# Altium schematic sheet EEG_TI.SchDoc
size A4
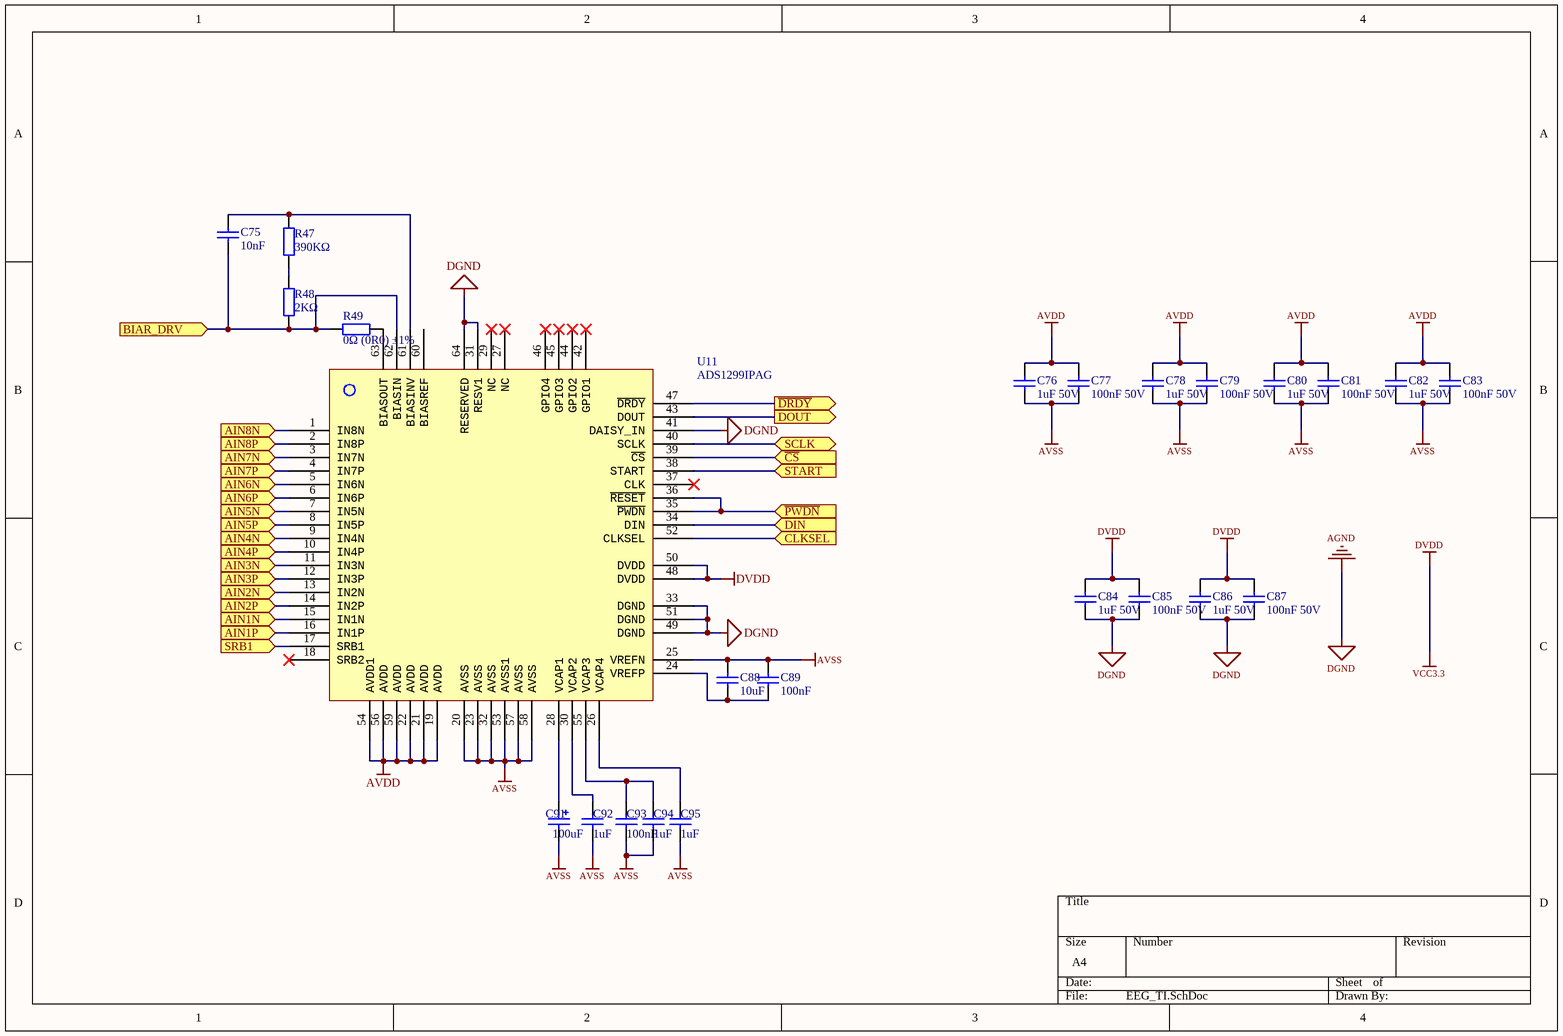
[diagram p0: EEG_TI.SchDoc]

## Parts
C75  10nF  [0402_C]
C76  1uF 50V  [0402_C]
C77  100nF 50V  [0402_C]
C78  1uF 50V  [0402_C]
C79  100nF 50V  [0402_C]
C80  1uF 50V  [0402_C]
C81  100nF 50V  [0402_C]
C82  1uF 50V  [0402_C]
C83  100nF 50V  [0402_C]
C84  1uF 50V  [0402_C]
C85  100nF 50V  [0402_C]
C86  1uF 50V  [0402_C]
C87  100nF 50V  [0402_C]
C88  10uF  [0402_C]
C89  100nF  [0402_C]
C91  100uF  [CASE-B_3528]
C92  1uF  [0603_C]
C93  100nF  [0402_C]
C94  1uF  [0603_C]
C95  1uF  [0603_C]
R47  390KΩ  [0603_R]
R48  2KΩ  [0402_R]
R49  0Ω (0R0) ±1%  [0402_R]
U11  ADS1299IPAG  [ADS1299]

## Ports
AIN1N (in), AIN1P (in), AIN2N (in), AIN2P (in), AIN3N (in), AIN3P (in), AIN4N (in), AIN4P (in), AIN5N (in), AIN5P (in), AIN6N (in), AIN6P (in), AIN7N (in), AIN7P (in), AIN8N (in), AIN8P (in), BIAR_DRV (in), CLKSEL (in), DIN (in), DOUT (out), SCLK (bidir), SRB1 (in), START (in), ~{CS} (in), ~{DRDY} (out), ~{PWDN} (in)

## Nets
AGND: C84.2 C85.2 C86.2 C87.2 U11.31(RESV1) U11.33(DGND) U11.41(DAISY_IN) U11.49(DGND) U11.51(DGND) U11.64(RESERVED)  [also labelled DGND]
AVDD: C76.1 C77.1 C78.1 C79.1 C80.1 C81.1 C82.1 C83.1 U11.19(AVDD) U11.21(AVDD) U11.22(AVDD) U11.54(AVDD1) U11.56(AVDD) U11.59(AVDD)
AVSS: C76.2 C77.2 C78.2 C79.2 C80.2 C81.2 C82.2 C83.2 C88.1 C89.2 C91.2 C92.1 C93.1 C94.1 C95.1 U11.20(AVSS) U11.23(AVSS) U11.25(VREFN) U11.32(AVSS) U11.53(AVSS1) U11.57(AVSS) U11.58(AVSS)
DVDD: C84.1 C85.1 C86.1 C87.1 U11.48(DVDD) U11.50(DVDD)  [also labelled VCC3.3]
AIN1N: U11.15(IN1N) ; port AIN1N
AIN1P: U11.16(IN1P) ; port AIN1P
AIN2N: U11.13(IN2N) ; port AIN2N
AIN2P: U11.14(IN2P) ; port AIN2P
AIN3N: U11.11(IN3N) ; port AIN3N
AIN3P: U11.12(IN3P) ; port AIN3P
AIN4N: U11.9(IN4N) ; port AIN4N
AIN4P: U11.10(IN4P) ; port AIN4P
AIN5N: U11.7(IN5N) ; port AIN5N
AIN5P: U11.8(IN5P) ; port AIN5P
AIN6N: U11.5(IN6N) ; port AIN6N
AIN6P: U11.6(IN6P) ; port AIN6P
AIN7N: U11.3(IN7N) ; port AIN7N
AIN7P: U11.4(IN7P) ; port AIN7P
AIN8N: U11.1(IN8N) ; port AIN8N
AIN8P: U11.2(IN8P) ; port AIN8P
BIAR_DRV: C75.1 R48.1 R49.2 U11.62(BIASIN) ; port BIAR_DRV
~{CS}: U11.39(~{CS}) ; port ~{CS}
CLKSEL: U11.52(CLKSEL) ; port CLKSEL
~{DRDY}: U11.47(~{DRDY}) ; port ~{DRDY}
DIN: U11.34(DIN) ; port DIN
DOUT: U11.43(DOUT) ; port DOUT
~{PWDN}: U11.35(~{PWDN}) U11.36(~{RESET}) ; port ~{PWDN}
SCLK: U11.40(SCLK) ; port SCLK
SRB1: U11.17(SRB1) ; port SRB1
START: U11.38(START) ; port START
NetC75_2: C75.2 R47.2 U11.61(BIASINV)
NetC88_2: C88.2 C89.1 U11.24(VREFP)
NetC91_1: C91.1 U11.28(VCAP1)
NetC92_2: C92.2 U11.30(VCAP2)
NetC93_2: C93.2 C94.2 U11.55(VCAP3)
NetC95_2: C95.2 U11.26(VCAP4)
NetR47_1: R47.1 R48.2
NetR49_1: R49.1 U11.63(BIASOUT)

Not connected (* = marked no-connect by the designer): U11 18(SRB2)* 27(NC)* 29(NC)* 37(CLK)* 42(GPIO1)* 44(GPIO2)* 45(GPIO3)* 46(GPIO4)* 60(BIASREF)

## Library data of the parts
C75 = 0402 10nF (103) 10% 50V: 贴片电容; ComponentLink1Description: 供应商链接; ComponentLink1URL: http://www.szlcsc.com/product/details_15869.html; Package: 0402; Supplier: LC; SuppliersPartNumber: C15195
C76-C87 = 0603 10nF (103) 10% 50V: 贴片电容; ComponentLink1Description: 供应商链接; ComponentLink1URL: http://www.szlcsc.com/product/details_58143.html; Package: 0603; Supplier: LC; SuppliersPartNumber: C57112
C88 = 0402 10uF (106) 20% 6.3V: 贴片电容; ComponentLink1Description: 供应商链接; ComponentLink1URL: http://www.szlcsc.com/product/details_16204.html; Package: 0402; Supplier: LC; SuppliersPartNumber: C15525
C89 C93 = 0402 100nF (104) 10% 16V: 贴片电容; ComponentLink1Description: 供应商链接; ComponentLink1URL: http://www.szlcsc.com/product/details_1877.html; Package: 0402; Supplier: LC; SuppliersPartNumber: C1525
C91 = 3528 100uF (107) 10% 6.3V: 钽电容; ComponentLink1Description: 供应商链接; ComponentLink1URL: http://www.szlcsc.com/product/details_16815.html; Package: 3528; Supplier: LC; SuppliersPartNumber: C16133
C92 C94 C95 = 0603 1uF (105) 10% 50V: 贴片电容; ComponentLink1Description: 供应商链接; ComponentLink1URL: http://www.szlcsc.com/product/details_16531.html; Package: 0603; Supplier: LC; SuppliersPartNumber: C15849
R47 = 0603 390KΩ (3903) 1%: 贴片电阻; ComponentLink1Description: 供应商链接; ComponentLink1URL: http://www.szlcsc.com/product/details_23877.html; Package: 0603; Supplier: LC; SuppliersPartNumber: C23150
R48 = 0402 2KΩ (2001) 1%: 贴片电阻; ComponentLink1Description: 供应商链接; ComponentLink1URL: http://www.szlcsc.com/product/details_4516.html; Package: 0402; Supplier: LC; SuppliersPartNumber: C4109
R49 = 0402 0Ω (0R0) 1%: 贴片电阻; ComponentLink1Description: 供应商链接; ComponentLink1URL: http://www.szlcsc.com/product/details_17853.html; Package: 0402; Supplier: LC; SuppliersPartNumber: C17168